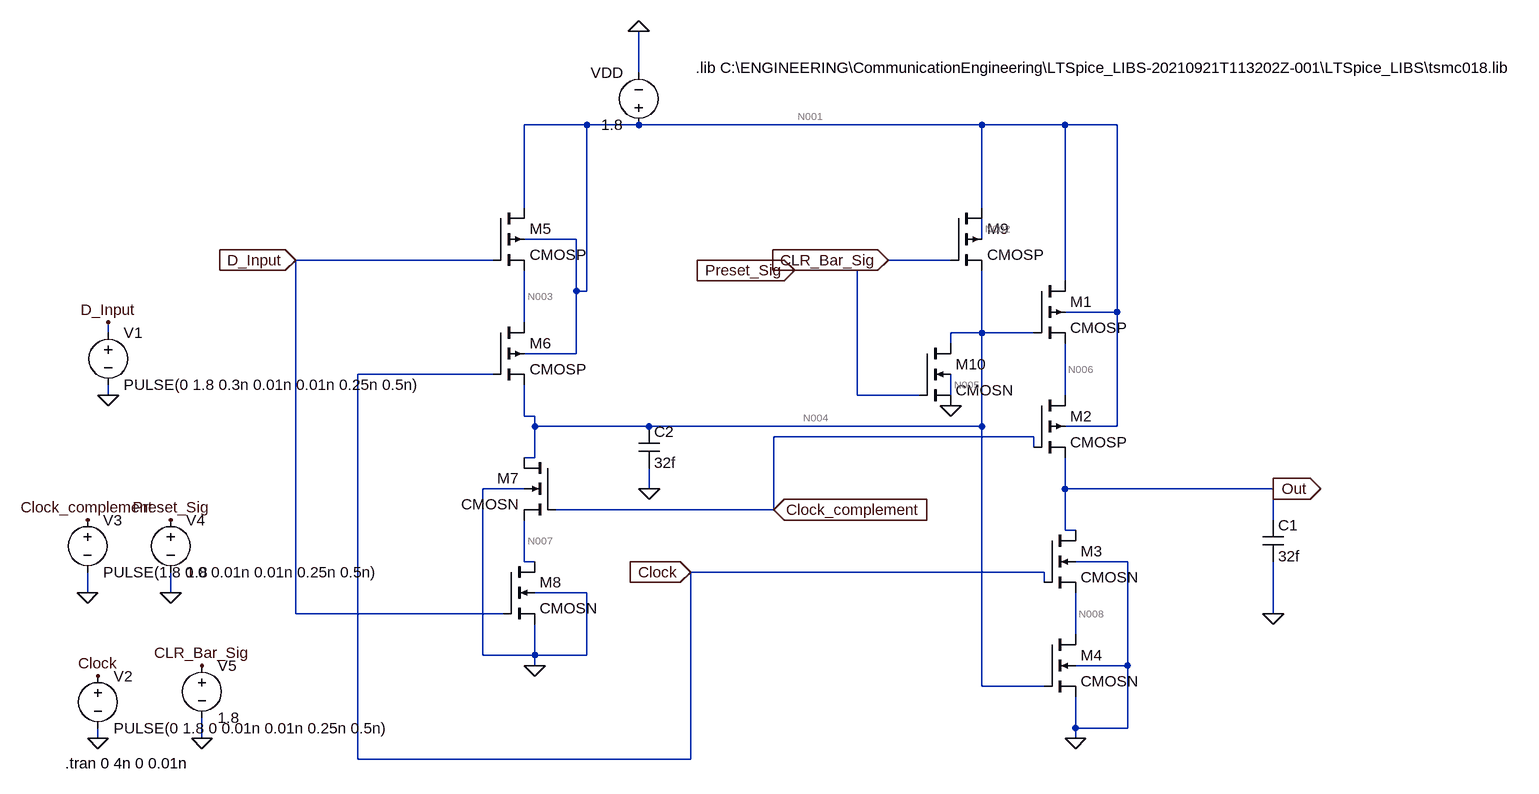
[diagram p0: schematic D_Flip_Flop_design_Pr_Clr.asc]
D_Flip_Flop_design_Pr_Clr.asc, the LTspice schematic file:
Version 4
SHEET 1 1324 1064
WIRE -160 -16 -160 -80
WIRE -240 64 -336 64
WIRE -160 64 -240 64
WIRE 368 64 -160 64
WIRE 496 64 368 64
WIRE 576 64 496 64
WIRE -336 192 -336 64
WIRE 368 192 368 64
WIRE -256 240 -336 240
WIRE 368 240 368 208
WIRE -384 272 -688 272
WIRE 320 272 224 272
WIRE 176 288 80 288
WIRE 496 304 496 64
WIRE -256 320 -256 240
WIRE -240 320 -240 64
WIRE -240 320 -256 320
WIRE 576 352 576 64
WIRE 576 352 496 352
WIRE -336 368 -336 288
WIRE -976 384 -976 368
WIRE 368 384 368 288
WIRE 368 384 320 384
WIRE 448 384 368 384
WIRE 320 400 320 384
WIRE -256 416 -256 320
WIRE -256 416 -336 416
WIRE -384 448 -592 448
WIRE -976 480 -976 464
WIRE 176 480 176 288
WIRE 272 480 176 480
WIRE 320 480 320 448
WIRE 496 480 496 400
WIRE -336 512 -336 464
WIRE -320 512 -336 512
WIRE -320 528 -320 512
WIRE -144 528 -320 528
WIRE 368 528 368 384
WIRE 368 528 -144 528
WIRE 576 528 576 352
WIRE 576 528 496 528
WIRE 448 544 48 544
WIRE 448 560 448 544
WIRE -320 576 -320 528
WIRE -320 576 -336 576
WIRE -336 624 -400 624
WIRE -144 624 -144 592
WIRE 496 624 496 576
WIRE 816 624 496 624
WIRE 48 656 48 544
WIRE 48 656 -288 656
WIRE 816 672 816 624
WIRE 496 688 496 624
WIRE 512 688 496 688
WIRE -336 736 -336 672
WIRE -320 736 -336 736
WIRE 592 736 512 736
WIRE 464 752 -80 752
WIRE 464 768 464 752
WIRE -1008 784 -1008 752
WIRE -880 784 -880 752
WIRE -240 784 -320 784
WIRE -688 816 -688 272
WIRE -368 816 -688 816
WIRE 816 816 816 736
WIRE 512 848 512 784
WIRE -400 880 -400 624
WIRE -320 880 -320 832
WIRE -320 880 -400 880
WIRE -240 880 -240 784
WIRE -240 880 -320 880
WIRE -320 896 -320 880
WIRE 592 896 592 736
WIRE 592 896 512 896
WIRE 368 928 368 528
WIRE 464 928 368 928
WIRE 512 992 512 944
WIRE 592 992 592 896
WIRE 592 992 512 992
WIRE -992 1008 -992 992
WIRE -832 1008 -832 976
WIRE 512 1008 512 992
WIRE -592 1040 -592 448
WIRE -80 1040 -80 752
WIRE -80 1040 -592 1040
FLAG -160 -80 0
FLAG 512 1008 0
FLAG 816 816 0
FLAG -320 896 0
FLAG -144 624 0
FLAG 320 496 0
FLAG 80 288 Preset_Sig
IOPIN 80 288 In
FLAG 224 272 CLR_Bar_Sig
IOPIN 224 272 In
FLAG -80 752 Clock
IOPIN -80 752 In
FLAG -688 272 D_Input
IOPIN -688 272 In
FLAG 48 656 Clock_complement
IOPIN 48 656 In
FLAG 816 624 Out
IOPIN 816 624 Out
FLAG -976 480 0
FLAG -992 1008 0
FLAG -1008 784 0
FLAG -880 784 0
FLAG -976 368 D_Input
FLAG -992 912 Clock
FLAG -1008 672 Clock_complement
FLAG -880 672 Preset_Sig
FLAG -832 1008 0
FLAG -832 896 CLR_Bar_Sig
SYMBOL pmos4 448 304 R0
SYMATTR InstName M1
SYMATTR Value CMOSP
SYMATTR Value2 l=180n w=440n
SYMBOL pmos4 448 480 R0
SYMATTR InstName M2
SYMATTR Value CMOSP
SYMATTR Value2 l=180n w=440n
SYMBOL nmos4 464 688 R0
SYMATTR InstName M3
SYMATTR Value CMOSN
SYMATTR Value2 l=180n w=220n
SYMBOL nmos4 464 848 R0
SYMATTR InstName M4
SYMATTR Value CMOSN
SYMATTR Value2 l=180n w=220n
SYMBOL voltage -160 80 R180
WINDOW 0 24 96 Left 2
WINDOW 3 24 16 Left 2
SYMATTR InstName VDD
SYMATTR Value 1.8
SYMBOL cap 800 672 R0
SYMATTR InstName C1
SYMATTR Value 32f
SYMBOL pmos4 -384 192 R0
SYMATTR InstName M5
SYMATTR Value CMOSP
SYMATTR Value2 l=180n w=440n
SYMBOL pmos4 -384 368 R0
SYMATTR InstName M6
SYMATTR Value CMOSP
SYMATTR Value2 l=180n w=440n
SYMBOL nmos4 -288 576 M0
SYMATTR InstName M7
SYMATTR Value CMOSN
SYMATTR Value2 l=180n w=220n
SYMBOL nmos4 -368 736 R0
SYMATTR InstName M8
SYMATTR Value CMOSN
SYMATTR Value2 l=180n w=220n
SYMBOL cap -160 528 R0
SYMATTR InstName C2
SYMATTR Value 32f
SYMBOL pmos4 320 192 R0
SYMATTR InstName M9
SYMATTR Value CMOSP
SYMATTR Value2 l=180n w=440n
SYMBOL nmos4 272 400 R0
SYMATTR InstName M10
SYMATTR Value CMOSN
SYMATTR Value2 l=180n w=220n
SYMBOL voltage -976 368 R0
WINDOW 123 0 0 Left 0
WINDOW 39 0 0 Left 0
SYMATTR InstName V1
SYMATTR Value PULSE(0 1.8 0.3n 0.01n 0.01n 0.25n 0.5n)
SYMBOL voltage -992 896 R0
WINDOW 123 0 0 Left 0
WINDOW 39 0 0 Left 0
SYMATTR InstName V2
SYMATTR Value PULSE(0 1.8 0 0.01n 0.01n 0.25n 0.5n)
SYMBOL voltage -1008 656 R0
WINDOW 123 0 0 Left 0
WINDOW 39 0 0 Left 0
SYMATTR InstName V3
SYMATTR Value PULSE(1.8 0 0 0.01n 0.01n 0.25n 0.5n)
SYMBOL voltage -880 656 R0
WINDOW 123 0 0 Left 0
WINDOW 39 0 0 Left 0
SYMATTR InstName V4
SYMATTR Value 1.8
SYMBOL voltage -832 880 R0
WINDOW 123 0 0 Left 0
WINDOW 39 0 0 Left 0
SYMATTR InstName V5
SYMATTR Value 1.8
TEXT -72 -24 Left 2 !.lib C:\\ENGINEERING\\CommunicationEngineering\\LTSpice_LIBS-20210921T113202Z-001\\LTSpice_LIBS\\tsmc018.lib
TEXT -1042 1046 Left 2 !.tran 0 4n 0 0.01n

The netlist it stands for:
* D_Flip_Flop_design_Pr_Clr.asc
M1 N001 N004 N006 N001 CMOSP l=180n w=440n
M2 N006 Clock_complement Out N001 CMOSP l=180n w=440n
M3 Out Clock N008 0 CMOSN l=180n w=220n
M4 N008 N004 0 0 CMOSN l=180n w=220n
VDD N001 0 1.8
C1 Out 0 32f
M5 N001 D_Input N003 N001 CMOSP l=180n w=440n
M6 N003 Clock N004 N001 CMOSP l=180n w=440n
M7 N004 Clock_complement N007 0 CMOSN l=180n w=220n
M8 N007 D_Input 0 0 CMOSN l=180n w=220n
C2 N004 0 32f
M9 N001 CLR_Bar_Sig N004 N002 CMOSP l=180n w=440n
M10 N004 Preset_Sig 0 N005 CMOSN l=180n w=220n
V1 D_Input 0 PULSE(0 1.8 0.3n 0.01n 0.01n 0.25n 0.5n)
V2 Clock 0 PULSE(0 1.8 0 0.01n 0.01n 0.25n 0.5n)
V3 Clock_complement 0 PULSE(1.8 0 0 0.01n 0.01n 0.25n 0.5n)
V4 Preset_Sig 0 1.8
V5 CLR_Bar_Sig 0 1.8
.model NMOS NMOS
.model PMOS PMOS
.lib standard.mos
.lib C:\ENGINEERING\CommunicationEngineering\LTSpice_LIBS-20210921T113202Z-001\LTSpice_LIBS\tsmc018.lib
.tran 0 4n 0 0.01n
.backanno
.end

* Results of the author's LTspice run, read from the files saved beside the schematic
* Operating Point, zero values left out:
*   V(n001) = 1.8 V
*   V(n004) = 146.4 mV
*   V(n006) = 1.8 V
*   V(clock_complement) = 1.8 V
*   V(out) = 52.32 mV
*   V(n008) = 432.9 µV
*   V(n003) = 1.44 V
*   V(n007) = 146.4 mV
*   V(clr_bar_sig) = 1.8 V
*   V(n002) = 1.652 V
*   V(preset_sig) = 1.8 V
*   V(n005) = 39.84 mV
*   Id(M10) = 67.7 µA
*   Is(M10) = -67.7 µA
*   Id(M8) = 7.383 pA
*   Is(M8) = -7.227 pA
*   Id(M7) = 7.696 pA
*   Is(M7) = -7.383 pA
*   Id(M4) = 5.522 pA
*   Is(M4) = -5.521 pA
*   Id(M3) = 5.583 pA
*   Is(M3) = -5.522 pA
*   Id(M9) = 17.39 pA
*   Ib(M9) = -1.652 pA
*   Is(M9) = -15.74 pA
*   Id(M6) = 67.7 µA
*   Ib(M6) = 2.034 pA
*   Is(M6) = -67.7 µA
*   Id(M5) = 67.7 µA
*   Is(M5) = -67.7 µA
*   Id(M2) = 3.825 pA
*   Ib(M2) = 1.758 pA
*   Is(M2) = -5.583 pA
*   Id(M1) = 3.825 pA
*   Is(M1) = -3.825 pA
*   I(Vdd) = -67.7 µA
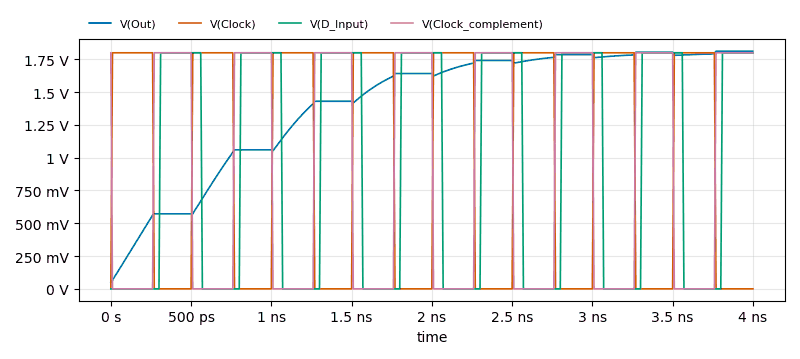
[diagram p1: Transient Analysis of D_Flip_Flop_design_Pr_Clr.asc, plotted from the saved traces]
* Transient Analysis, 1 run:
*   V(Out): min 51.48 mV, max 1.812 V, average 1.416 V, rms 1.494 V, last 1.812 V
*   V(Clock): min 0 V, max 1.8 V, average 936 mV, rms 1.29 V, last 0 V
*   V(D_Input): min 0 V, max 1.8 V, average 906.7 mV, rms 1.27 V, last 1.8 V
*   V(Clock_complement): min 0 V, max 1.8 V, average 864 mV, rms 1.239 V, last 1.8 V